# EAGLE design tenere-controller-rev-B (EAGLE 7.3.0)
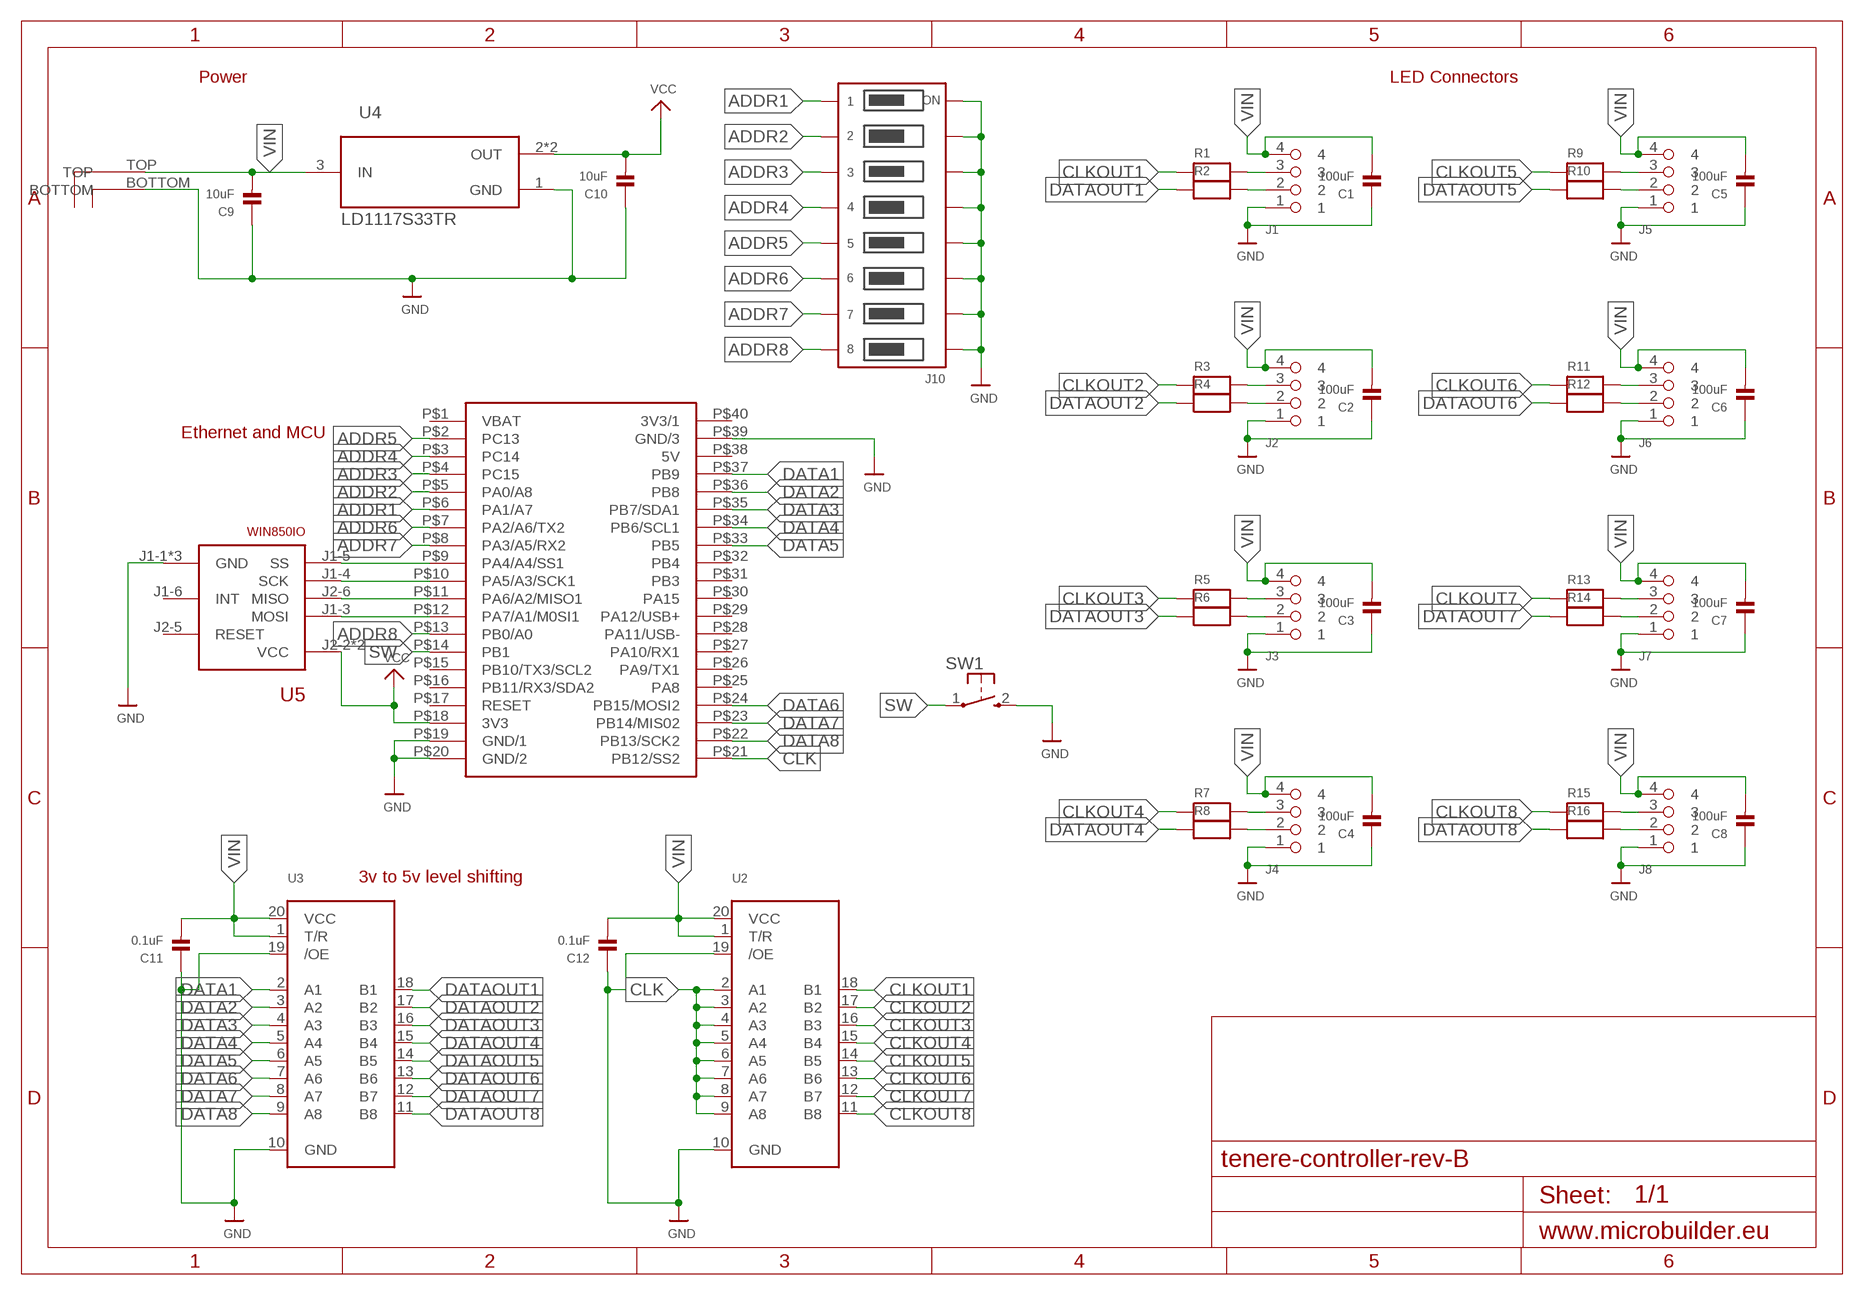
[diagram p0: schematic, sheet 1]

## Parts
C1  100uF  CAP_CERAMIC1206  [1206]
C2  100uF  CAP_CERAMIC1206  [1206]
C3  100uF  CAP_CERAMIC1206  [1206]
C4  100uF  CAP_CERAMIC1206  [1206]
C5  100uF  CAP_CERAMIC1206  [1206]
C6  100uF  CAP_CERAMIC1206  [1206]
C7  100uF  CAP_CERAMIC1206  [1206]
C8  100uF  CAP_CERAMIC1206  [1206]
C9  10uF  CAP_CERAMIC0603  [0603]
C10  10uF  CAP_CERAMIC0603  [0603]
C11  0.1uF  CAP_CERAMIC0603  [0603]
C12  0.1uF  CAP_CERAMIC0603  [0603]
J1  MICROFIT3  [43650-0400]
J2  MICROFIT3  [43650-0400]
J3  MICROFIT3  [43650-0400]
J4  MICROFIT3  [43650-0400]
J5  MICROFIT3  [43650-0400]
J6  MICROFIT3  [43650-0400]
J7  MICROFIT3  [43650-0400]
J8  MICROFIT3  [43650-0400]
J10  DIP-SWITCH-8PIN  [BPA08B]
PWR  POWERPOLE-2V  [POWERPOLE_STACKED]
R1  RESISTOR0603  [0603]
R2  RESISTOR0603  [0603]
R3  RESISTOR0603  [0603]
R4  RESISTOR0603  [0603]
R5  RESISTOR0603  [0603]
R6  RESISTOR0603  [0603]
R7  RESISTOR0603  [0603]
R8  RESISTOR0603  [0603]
R9  RESISTOR0603  [0603]
R10  RESISTOR0603  [0603]
R11  RESISTOR0603  [0603]
R12  RESISTOR0603  [0603]
R13  RESISTOR0603  [0603]
R14  RESISTOR0603  [0603]
R15  RESISTOR0603  [0603]
R16  RESISTOR0603  [0603]
SW1  TACTILE-SWITCH-1825027  [1825027]
U1  BLUEPILL  [40-DIP-BLUE-PIL]
U2  74LCX245  [TSSOP20]
U3  74LCX245  [TSSOP20]
U4  LD1117S33TR  [LD1117S33TR_SOT230P700X180-4N]
U5  WIN850IO  [WIZ850IO]

## Nets
ADDR1: J10.1'(1B) U1.P$6(PA1/A7)
ADDR2: J10.2'(2B) U1.P$5(PA0/A8)
ADDR3: J10.3'(3B) U1.P$4(PC15)
ADDR4: J10.4'(4B) U1.P$3(PC14)
ADDR5: J10.5'(5B) U1.P$2(PC13)
ADDR6: J10.6'(6B) U1.P$7(PA2/A6/TX2)
ADDR7: J10.7'(7B) U1.P$8(PA3/A5/RX2)
ADDR8: J10.8'(8B) U1.P$13(PB0/A0)
CLK: U1.P$21(PB12/SS2) U2.2(A1) U2.3(A2) U2.4(A3) U2.5(A4) U2.6(A5) U2.7(A6) U2.8(A7) U2.9(A8)
CLKOUT1: R1.1 U2.18(B1)
CLKOUT2: R3.1 U2.17(B2)
CLKOUT3: R5.1 U2.16(B3)
CLKOUT4: R7.1 U2.15(B4)
CLKOUT5: R9.1 U2.14(B5)
CLKOUT6: R11.1 U2.13(B6)
CLKOUT7: R13.1 U2.12(B7)
CLKOUT8: R15.1 U2.11(B8)
DATA1: U1.P$37(PB9) U3.2(A1)
DATA2: U1.P$36(PB8) U3.3(A2)
DATA3: U1.P$35(PB7/SDA1) U3.4(A3)
DATA4: U1.P$34(PB6/SCL1) U3.5(A4)
DATA5: U1.P$33(PB5) U3.6(A5)
DATA6: U1.P$24(PB15/MOSI2) U3.7(A6)
DATA7: U1.P$23(PB14/MIS02) U3.8(A7)
DATA8: U1.P$22(PB13/SCK2) U3.9(A8)
DATAOUT1: R2.1 U3.18(B1)
DATAOUT2: R4.1 U3.17(B2)
DATAOUT3: R6.1 U3.16(B3)
DATAOUT4: R8.1 U3.15(B4)
DATAOUT5: R10.1 U3.14(B5)
DATAOUT6: R12.1 U3.13(B6)
DATAOUT7: R14.1 U3.12(B7)
DATAOUT8: R16.1 U3.11(B8)
GND: C1.1 C2.1 C3.1 C4.1 C5.1 C6.1 C7.1 C8.1 C9.1 C10.1 C11.1 C12.1 J1.1 J2.1 J3.1 J4.1 J5.1 J6.1 J7.1 J8.1 J10.1(1A) J10.2(2A) J10.3(3A) J10.4(4A) J10.5(5A) J10.6(6A) J10.7(7A) J10.8(8A) PWR.BOTTOM SW1.2 U1.P$19(GND/1) U1.P$20(GND/2) U1.P$39(GND/3) U2.10(GND) U2.19(/OE) U3.10(GND) U3.19(/OE) U4.1(GND) U5.J1-1(GND) U5.J1-2(GND) U5.J2-1(GND)
N$1: U1.P$9(PA4/A4/SS1) U5.J1-5(SS)
N$2: U1.P$10(PA5/A3/SCK1) U5.J1-4(SCK)
N$3: U1.P$11(PA6/A2/MISO1) U5.J2-6(MISO)
N$4: U1.P$12(PA7/A1/M0SI1) U5.J1-3(MOSI)
N$5: J1.3 R1.2
N$6: J1.2 R2.2
N$7: J2.3 R3.2
N$8: J2.2 R4.2
N$9: J3.3 R5.2
N$10: J3.2 R6.2
N$11: J4.3 R7.2
N$12: J4.2 R8.2
N$13: J5.3 R9.2
N$14: J5.2 R10.2
N$15: J6.3 R11.2
N$16: J6.2 R12.2
N$17: J7.3 R13.2
N$18: J7.2 R14.2
N$19: J8.3 R15.2
N$20: J8.2 R16.2
SW: SW1.1 U1.P$14(PB1)
VCC: C10.2 U1.P$18(3V3) U4.2(OUT) U4.4(OUT) U5.J2-2(VCC) U5.J2-3(VCC)
VIN: C1.2 C2.2 C3.2 C4.2 C5.2 C6.2 C7.2 C8.2 C9.2 C11.2 C12.2 J1.4 J2.4 J3.4 J4.4 J5.4 J6.4 J7.4 J8.4 PWR.TOP U2.1(T/R) U2.20(VCC) U3.1(T/R) U3.20(VCC) U4.3(IN)
Unconnected: U1.P$1(VBAT) U1.P$15(PB10/TX3/SCL2) U1.P$16(PB11/RX3/SDA2) U1.P$17(RESET) U1.P$25(PA8) U1.P$26(PA9/TX1) U1.P$27(PA10/RX1) U1.P$28(PA11/USB-) U1.P$29(PA12/USB+) U1.P$30(PA15) U1.P$31(PB3) U1.P$32(PB4) U1.P$38(5V) U1.P$40(3V3/1) U5.J1-6(INT) U5.J2-5(RESET)

## Notes on the sheet
- Power | LED Connectors
- Ethernet and MCU
- 3v to 5v level shifting

## Library data of the parts
C1-C12 = microbuilder:CAP_CERAMIC: Ceramic Capacitors 0402 - 0402 Surface Mount Capacitors 16pF 50V 5% [Digikey: 445-4899-2-ND] 18pF 50V 5% [Digikey: 490-1281-2-ND] 22pF 50V 5% [Digikey: 490-1283-2-ND] 68pF 50V 5% [Digikey: 490-1289-2-ND] 0.1uF 10V 10% [Digikey: 490-1318-2-ND] 1.0uF 6.3V 10% [Digikey: 490-1320-2-ND] 0603 - 0603 Surface Mount Capacitors 16 pF 50V 5% [Digikey: 445-5051-2-ND] 22 pF 50V [Digikey: PCC220ACVTR-ND] 33 pF 50V 5% [Digikey: 490-1415-1-ND] 56pF 50V 5% [Digikey: 490-1421-1-ND] 220pF 50V 5% [Digikey: 445-1285-1-ND] 680 pF 50V 2200 pF 50V 5% C0G [Digikey: 445-1297-1-ND] 5600 pF 100V 5% X7R [Digikey: 478-3711-1-ND] 0.1 µF 25V 10% [Digikey: PCC2277TR-ND] 0.22 µF 16V 10% X7R [Digikey: 445-1318-1-ND] 1.0 µF 25V 10% [Digikey: 445-5146-2-ND] 0603 - RF Specific 3pF 250V +/-0.1pF RF [Digikey: 712-1347-1-ND] 18 pF 250V 5% [Digikey: 478-3505-1-ND or 712-1322-1-ND] 56 pF 250V 5% C0G RF [Digikey: 490-4867-1-ND] 68 pF 250V RF [Digikey: 490-4868-1-ND] 0805 - 0805 Surface Mount Capacitors 220 pF 250V 2% RF Ceramic Capacitor [Digikey: 712-1398-1-ND] 1000 pF 50V 2% NP0 Ceramic Capacitor [Digikey: 478-3760-1-ND] 0.1 µF 25V 10% Ceramic Capacitor [Digikey: PCC1828TR-ND] 1.0 µF 16V 10% Ceramic Capacitor[Digikey: 490-1691-2-ND] 10.0 µF 10V 10% Ceramic Capacitor[Digikey: 709-1228-1-ND] 10.0 uF 16V 10% Ceramic Capacitor [Digikey: 478-5165-2-ND] 47 uF 6.3V 20% Ceramic Capacitor [Digikey: 587-1779-1-ND or 399-5506-1-ND] 1206 - 1206 Surface Mount Capacitors 47uF 10V 20% Ceramic Capacitor [Digikey: 490-5528-1-ND or 399-5508-1-ND or 445-6010-1-ND] 100uF 6.3V -20%, +80% Y5V Ceramic Capacitor (Digikey: 490-4512-1-ND, Mouser: 81-GRM31CF50J107ZE1L)
J1-J8 = Custom:MICROFIT3
J10 = Custom:DIP-SWITCH-8PIN
PWR = Custom:POWERPOLE-2V
R1-R16 = microbuilder:RESISTOR: Resistors 0402 - 0402 Surface Mount Package 22 Ohm 1% 1/16W [Digikey: 311-22.0LRTR-ND] 33 Ohm 5% 1/16W 1.0K 5% 1/16W 1.5K 5% 1/16W 2.0K 1% 1/16W 10.0K 1% 1/16W [Digikey: 311-10.0KLRTR-ND] 10.0K 5% 1/16W [Digikey: RMCF0402JT10K0TR-ND] 12.1K 1% 1/16W [Digikey: 311-22.0LRTR-ND] 100.0K 5% 1/16W 0603 - 0603 Surface Mount Package 0 Ohm 1/10 Watt 1% Resistor 15 Ohm 1/10 Watt 1% Resistor 33 Ohm 1/10 Watt 1% Resistor 49.9 Ohm 1/10 Watt 1% Resistor 100 Ohm 1/10 Watt 1% Resistor 150 Ohm 1/10 Watt 1% Resistor 240 Ohm 1/10 Watt 1% Resistor 390 Ohm 1/10 Watt 1% Resistor 560 Ohm 1/10 Watt 1% Resistor 680 Ohm 1/10 Watt 1% Resistor 750 Ohm 1/10 Watt 1% Resistor 1.0K Ohm 1/10 Watt 1% Resistor 1.5K Ohm 1/10 Watt 1% Resistor 2.0K Ohm 1/10 Watt 1% Resistor 2.2K Ohm 1/10 Watt 1% Resistor 3.3K Ohm 1/10 Watt 1% Resistor 4.7K Ohm 1/10 Watt 1% Resistor 10.0K Ohm 1/10 Watt 1% Resistor 12.0K Ohm 1/10 Watt 1% Resistor 12.1K Ohm 1/10 Watt 1% Resistor 20.0K Ohm 1/10 Watt 1% Resistor 33.0K Ohm 1/10 Watt 1% Resistor 100.0K Ohm 1/10 Watt 1% Resistor 0805 - 0805 Surface Mount Package 0 Ohm 1/8 Watt 1% Resistor 33 Ohm 1/8 Watt 1% Resistor 100 Ohm 1/8 Watt 1% Resistor 150 Ohm 1/8 Watt 1% Resistor 200 Ohm 1/8 Watt 1% Resistor 240 Ohm 1/8 Watt 1% Resistor 330 Ohm 1/8 Watt 1% Resistor 390 Ohm 1/8 Watt 1% Resistor 470 Ohm 1/8 Watt 1% Resistor 1.0K Ohm 1/8 Watt 1% Resistor 1.5K Ohm 1/8 Watt 1% Resistor 2.0K Ohm 1/8 Watt 1% Resistor 4.7K Ohm 1/8 Watt 1% Resistor 5.1K Ohm 1/8 Watt 1% Resistor 5.6K Ohm 1/8 Watt 1% Resistor 10.0K Ohm 1/8 Watt 1% Resistor 22.0K Ohm 1/8 Watt 1% Resistor 33.0K Ohm 1/8 Watt 1% Resistor 100K Ohm 1/8 Watt 1% Resistor 1206 - 1206 Surface Mount Package 2012 - 2010 Surface Mount Package 0.11 Ohm 1/2 Watt 1% Resistor - Digikey: RHM.11UCT-ND
SW1 = Custom:TACTILE-SWITCH-1825027
U1 = maplemini:BLUEPILL
U2 U3 = microbuilder:74LCX245: 74LCX245MTC - 5.0V Tolerant Bi-Directional Buffer Can be used to interface 5.0V logic to 2.5 or 3.3V devices Digikey: 74LCX245MTCXTR-ND Mouser: 512-74LCX245MTCX
U4 = Common-Parts-Library-Eagle:LD1117S33TR: LDO Voltage Regulators 3.3V 0.8A Positive; MANUFACTURER: ST Microelectronics
U5 = Custom:WIN850IO

## Board
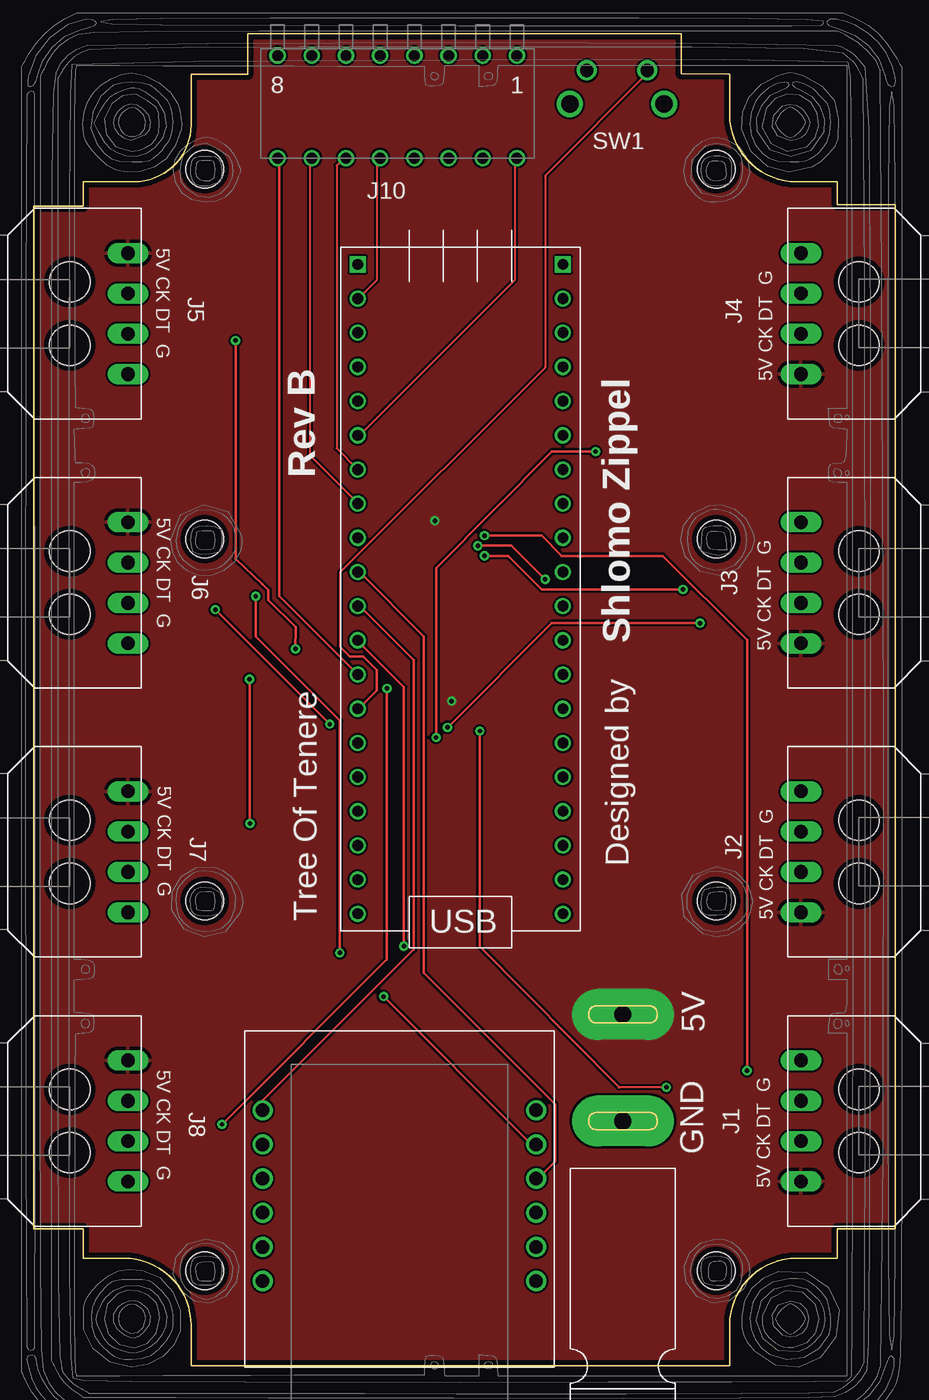
[diagram p1: board, top side]
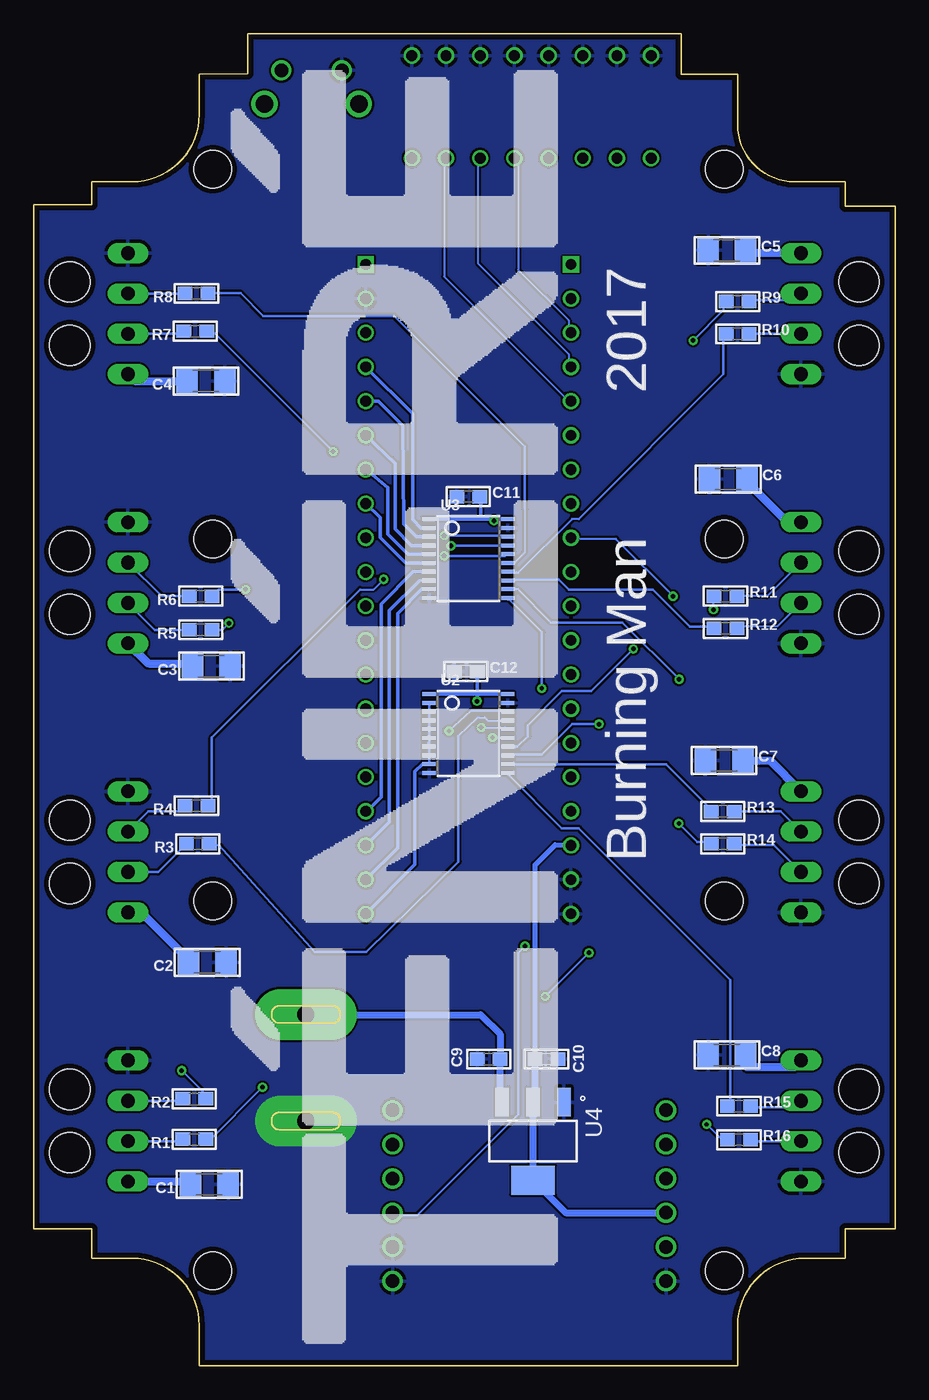
[diagram p2: board, bottom side, seen from below]

Size 64 x 99.01 mm. Coordinates in mm from the lower left corner, seen from the top.
Outline: 11.7,96 15.89,96 15.89,99.01 48.1,99.01 48.1,96.01 51.7,96 51.7,93 arc90 56.7,88 59.7,88 59.7,86.3 64,86.3 64,10.2 59.7,10.2 59.7,8 56.7,8 arc90 51.7,3 51.7,0 11.7,0 11.7,3 arc90 6.7,8 3.7,8 3.7,10.2 0,10.2 0,86.2 3.7,86.2 3.7,88 7.46,88 arc90 11.7,92.24 11.7,96
Copper layers (1*16): Top 0.0356mm / dielectric 1.5011mm / Bottom 0.0356mm
Design rules "oshpark-2layer": minimum track width 6mil, minimum drill 13mil, track to track 6mil, track to pad 6mil, pad to pad 6mil, via to via 6mil, smd to smd 6mil, copper to edge 15mil, drill to drill 6mil, minimum pad ring 7mil, minimum via ring 7mil, stop-mask expansion 4mil, vias tented up to drill 0mil, thermal gap 10mil

### Footprints (pad centres in the part's own frame; a part is rotated, then mirrored left to right if it is on the bottom)
1206 = smd 1.6 x 1.8: 1 -1.4,0; 2 1.4,0
0603 = smd 1.1 x 1: 1 -0.85,0; 2 0.85,0
43650-0400 = drill 1.02 long: 1 -4.5,0; 2 -1.5,0; 3 1.5,0; 4 4.5,0 | hole 3: -2.35,4.32; 2.35,4.32
BPA08B = drill 0.813: 1 -8.89,-3.81; 1' -8.89,3.81; 2 -6.35,-3.81; 2' -6.35,3.81; 3 -3.81,-3.81; 3' -3.81,3.81; 4 -1.27,-3.81; 4' -1.27,3.81; 5 1.27,-3.81; 5' 1.27,3.81; 6 3.81,-3.81; 6' 3.81,3.81; 7 6.35,-3.81; 7' 6.35,3.81; 8 8.89,-3.81; 8' 8.89,3.81
POWERPOLE_STACKED = drill 1.27 pad 3.8 long: BOTTOM 0,7.92; TOP 0,0
1825027 = drill 0.991: 1 -2.248,-2.489; 2 2.248,-2.489 | drill 1.295: FRAME1 -3.505,0; FRAME2 3.505,0
40-DIP-BLUE-PIL = drill 0.8 square: P$1 -7.62,22.86; P$40 7.62,22.86 | drill 0.8: P$2 -7.62,20.32; P$3 -7.62,17.78; P$4 -7.62,15.24; P$5 -7.62,12.7; P$6 -7.62,10.16; P$7 -7.62,7.62; P$8 -7.62,5.08; P$9 -7.62,2.54; P$10 -7.62,0; P$11 -7.62,-2.54; P$12 -7.62,-5.08; P$13 -7.62,-7.62; P$14 -7.62,-10.16; P$15 -7.62,-12.7; P$16 -7.62,-15.24; P$17 -7.62,-17.78; P$18 -7.62,-20.32; P$19 -7.62,-22.86; P$20 -7.62,-25.4; P$21 7.62,-25.4; P$22 7.62,-22.86; P$23 7.62,-20.32; P$24 7.62,-17.78; P$25 7.62,-15.24; P$26 7.62,-12.7; P$27 7.62,-10.16; P$28 7.62,-7.62; P$29 7.62,-5.08; P$30 7.62,-2.54; P$31 7.62,0; P$32 7.62,2.54; P$33 7.62,5.08; P$34 7.62,7.62; P$35 7.62,10.16; P$36 7.62,12.7; P$37 7.62,15.24; P$38 7.62,17.78; P$39 7.62,20.32
TSSOP20 = smd 0.305 x 0.991: 1 -2.925,-2.918; 2 -2.275,-2.918; 3 -1.625,-2.918; 4 -0.975,-2.918; 5 -0.325,-2.918; 6 0.325,-2.918; 7 0.975,-2.918; 8 1.625,-2.918; 9 2.275,-2.918; 10 2.925,-2.918; 11 2.925,2.918; 12 2.275,2.918; 13 1.625,2.918; 14 0.975,2.918; 15 0.325,2.918; 16 -0.325,2.918; 17 -0.975,2.918; 18 -1.625,2.918; 19 -2.275,2.918; 20 -2.925,2.918
LD1117S33TR_SOT230P700X180-4N = smd 2.15 x 1: 1 -2.9,2.3; 2 -2.9,0; 3 -2.9,-2.3 | smd 2.15 x 3.25: 4 2.9,0
WIZ850IO = drill 1: J1-1 -10.16,18.6; J1-2 -10.16,16.06; J1-3 -10.16,13.52; J1-4 -10.16,10.98; J1-5 -10.16,8.44; J1-6 -10.16,5.9; J2-1 10.16,18.6; J2-2 10.16,16.06; J2-3 10.16,13.52; J2-4 10.16,10.98; J2-5 10.16,8.44; J2-6 10.16,5.9
105*65 = hole 2.8: -40.95,19; -13.45,19; 13.45,19; 40.95,19; -40.95,-19; -13.45,-19; 13.45,-19; 40.95,-19

### Placement (x,y rotation side)
C1  50.95,13.49 180 bottom
C2  51.1,30 180 bottom
C3  50.8,52 180 bottom
C4  51.2,73.2 180 bottom
C5  12.5,82.9 0 bottom
C6  12.4,65.9 0 bottom
C7  12.7,45 0 bottom
C8  12.5,23.1 0 bottom
C9  30.2,22.8 0 bottom
C10  25.9,22.8 180 bottom
C11  31.7,64.6 0 bottom
C12  31.9,51.6 0 bottom
J1  57,18.2 270 top
J2  57,38.2 270 top
J3  57,58.2 270 top
J4  57,78.2 270 top
J5  7,78.2 90 top
J6  7,58.2 90 top
J7  7,38.2 90 top
J8  7,18.2 90 top
J10  27.01,93.56 180 top
PWR  43.78,26.11 180 top
R1  52.07,16.84 180 bottom
R2  52.07,19.85 180 bottom
R3  51.8,38.8 180 bottom
R4  51.9,41.63 180 bottom
R5  51.6,54.7 180 bottom
R6  51.6,57.2 180 bottom
R7  52,76.9 180 bottom
R8  51.9,79.7 180 bottom
R9  11.7,79.1 0 bottom
R10  11.7,76.7 0 bottom
R11  12.6,57.2 0 bottom
R12  12.6,54.8 0 bottom
R13  12.8,41.2 0 bottom
R14  12.8,38.8 0 bottom
R15  11.6,19.3 0 bottom
R16  11.6,16.8 0 bottom
SW1  43.34,93.79 180 top
U1  31.7,59 0 top
U2  31.7,47 270 bottom
U3  31.7,60 270 bottom
U4  26.9,16.7 270 bottom
U5  27.18,24.9 180 top
U$15  [105*65]  31.7,48 90 top

### Tracks (layer width: path | path; a pad name or v marks a point on that pad's centre or on a via)
ADDR1
  Top 0.152: U1.P$6 24.25,69.2 35.75,80.7 35.75,89.7 J10.1'
ADDR2
  Bottom 0.152: U1.P$5 24.25,71.7 33.5,80.95 33.5,89.7 J10.2'
ADDR3
  Bottom 0.152: U1.P$4 24.25,74.45 24.25,75.2 31,81.95 31,89.7 J10.3'
ADDR4
  Bottom 0.152: U1.P$3 24.25,76.95 24.25,77.7 28,81.45 28,89.45 28.25,89.7 J10.4'
ADDR5
  Top 0.152: U1.P$2 24.25,79.45 25.5,80.7 25.5,89.7 J10.5'
ADDR6
  Top 0.152: U1.P$7 22.5,68.2 22.5,89.2 23,89.7 J10.6'
ADDR7
  Top 0.152: U1.P$8 24,64.2 20.5,67.7 20.5,89.7 J10.7'
ADDR8
  Top 0.152: 24,51.45 U1.P$13 | 18.25,89.7 J10.8'
  Top 0.203: 24,51.45 18.25,57.2 18.25,89.7
CLK
  Bottom 0.203: U2.9 U2.8 U2.7 34.62,46.27 | 34.62,46.27 U2.6 | U2.2 U2.3 U2.4 U2.5 U2.6 | 34.62,46.27 34.64,46.3 34.68,46.3 34.62,46.36 U2.6
  Bottom 0.254: U1.P$21 35.67,37.25 35.67,44.16 35.11,44.73 U2.9
CLKOUT1  (via drill 0.33)
  Top 0.152: v47,20.7 43.5,20.7
  Top 0.203: v33.14,47.18 33.14,31.18 43.5,20.7
  Bottom 0.152: 28.85,48.53 U2.18 29,48.7 31.5,48.7 v33.14,47.18 | v47,20.7 51,16.7 R1.1
CLKOUT2
  Bottom 0.152: 28.85,47.9 U2.17 29,47.95 30.25,47.95 30.5,48.2 31,48.2 32.46,46.81 | 50.25,38.7 50.75,38.7 R3.1
  Bottom 0.203: 32.46,46.81 32.44,37.47 39.28,30.75 43.12,30.75 50.25,38.7
CLKOUT3  (via drill 0.33)
  Top 0.152: 38.5,55.2 v30.75,47.45
  Top 0.203: v49.5,55.2 38.5,55.2
  Bottom 0.152: 28.54,47.26 U2.16 29,47.45 v30.75,47.45
  Bottom 0.203: v49.5,55.2 50,54.7 R5.1
CLKOUT4  (via drill 0.33)
  Top 0.203: v29.9,46.7 29.93,59.28 38.5,67.95 v41.75,67.95
  Bottom 0.152: 28.85,46.62 U2.15 29,46.7 v29.9,46.7 | 50.5,76.7 51,76.7 R7.1
  Bottom 0.203: 50.5,76.7 v41.75,67.95
CLKOUT5  (via drill 0.33)
  Top 0.203: v19.45,53.28 19.47,54.87 19.47,54.89 17.44,56.92 17.44,57.66 16.98,58.12 15,59.95 v15,76.2
  Bottom 0.152: 28.22,45.99 28.25,45.99 | 28.25,45.99 28.54,45.99 U2.14 | 12.75,78.45 12.75,78.95 R9.1 | 28.25,45.95 28.25,45.99
  Bottom 0.203: 12.75,78.45 v15,76.2 | v19.45,53.28 22.59,50.14 24.76,50.14 27.3,47.6 27.3,46.79 28.06,46.03 U2.14
CLKOUT6  (via drill 0.33)
  Top 0.203: v13.5,56.2 v22,47.7
  Bottom 0.152: 28.54,45.36 U2.13 28.75,45.45 | 13.5,57.2 R11.1
  Bottom 0.203: 28.75,45.45 26.25,45.45 24,47.7 v22,47.7 | 13.5,57.2 v13.5,56.2
CLKOUT7
  Bottom 0.152: 28.22,44.72 28.25,44.72 | 28.25,44.72 28.54,44.72 U2.12 | 28.25,44.7 28.25,44.72 | 13.5,41.2 R13.1
  Bottom 0.203: 28.25,44.7 17,44.7 13.5,41.2
CLKOUT8
  Bottom 0.152: 28.54,44.09 U2.11 28.75,43.95 | 12.25,19.45 R15.1
  Bottom 0.203: 28.75,43.95 24.75,39.95 23.5,39.95 12.25,28.7 12.25,19.45
DATA1
  Bottom 0.254: U1.P$37 35.83,70.77 35.83,62.88 35.24,62.28 U3.2
DATA2
  Bottom 0.254: U3.3 35.59,61.62 36.51,62.55 36.56,69.9 38.4,71.7 U1.P$36
DATA3
  Bottom 0.254: U3.4 35.96,60.98 37.12,62.19 37.12,67.06 U1.P$35
DATA4
  Bottom 0.254: U3.5 36.23,60.35 37.68,61.84 37.68,65.28 39.3,66.62 U1.P$34
DATA5
  Bottom 0.254: U3.6 36.37,59.67 38.24,61.57 38.24,63.03 U1.P$33
DATA6
  Bottom 0.254: U1.P$24 39.25,41.22 38.19,42.28 38.19,56.62 35.79,59.03 U3.7
DATA7
  Bottom 0.203: 35.33,58.38 U3.8
  Bottom 0.254: U1.P$23 37.58,40.42 37.58,56.12 35.33,58.38
DATA8
  Bottom 0.203: 35.16,57.73 U3.9
  Bottom 0.254: U1.P$22 36.97,38.49 36.97,55.92 35.16,57.73
DATAOUT1  (via drill 0.33)
  Top 0.203: v33.5,61.7 37.75,61.7 39.25,60.2 46.75,60.2 53,53.95 v53,21.95
  Bottom 0.152: 28.85,61.55 U3.18 29,61.7 | 51,19.95 R2.1
  Bottom 0.203: v33.5,61.7 29,61.7 | 51,19.95 v53,21.95
DATAOUT2  (via drill 0.33)
  Top 0.203: v33,60.95 35.5,60.95 v38,58.45
  Bottom 0.152: 28.54,60.91 U3.17 29,60.95 | v38,58.45 38.75,57.7 39.75,57.7 | 50.75,41.45 R4.1
  Bottom 0.203: v33,60.95 29,60.95 | 39.75,57.7 50.75,46.7 50.75,41.45
DATAOUT3  (via drill 0.33)
  Top 0.203: v33.5,60.2 35.25,60.2 37.75,57.7 v48.25,57.7
  Bottom 0.152: 28.85,60.28 U3.16 29,60.2 | R6.1 50.25,57.7
  Bottom 0.203: v33.5,60.2 29,60.2 | 50.25,57.7 v48.25,57.7
DATAOUT4
  Bottom 0.152: 28.54,59.64 U3.15 28.5,59.7 28.25,59.7 27.5,60.45 27.5,63.7 | 51.25,79.7 R8.1
  Bottom 0.203: 27.5,63.7 27.5,68.33 37.2,78.03 46.93,78.03 48.63,79.73 51.02,79.73 R8.1
DATAOUT5
  Bottom 0.152: 28.54,59.01 U3.14 28.5,58.95 | 23.5,62.95 24,62.95 | 12.75,76.7 R10.1
  Bottom 0.203: 28.5,58.95 28,58.95 24,62.95 | 23.5,62.95 12.75,73.7 12.75,76.7
DATAOUT6
  Bottom 0.152: 28.22,58.37 28.54,58.37 U3.13 28.75,58.45 | 24.25,57.7 25,58.45 | 13.5,54.95 R12.1
  Bottom 0.203: 25,58.45 28.75,58.45 | 24.25,57.7 18,57.7 15.25,54.95 13.5,54.95
DATAOUT7  (via drill 0.33)
  Top 0.203: v16.07,40.31 16.07,51 v16.04,51.03
  Bottom 0.152: 28.54,57.74 U3.12 28.5,57.7 | 13.5,38.95 R14.1
  Bottom 0.203: 13.5,38.95 14.71,38.95 v16.07,40.31 | v16.04,51.03 20.26,55.25 25.57,55.25 28.05,57.73 U3.12
DATAOUT8  (via drill 0.33)
  Top 0.203: v26.25,50.35 26.25,30.2 v14,17.95
  Bottom 0.152: 28.54,57.1 U3.11 28.75,56.95 | 12.5,16.45 12.5,16.95 R16.1
  Bottom 0.203: 12.5,16.45 v14,17.95 | v26.25,50.35 26.25,54.54 U3.11
GND
  pour Bottom: -0.3,100 63.7,100 63.7,-1 -0.3,-1
N$1  (via drill 0.33)
  Top 0.152: 36.75,16.7 37.25,16.7 U5.J1-5
  Top 0.203: v16.5,57.2 16.5,54.2 22.75,47.95 v22.75,30.7 | 36.75,16.7 v26,27.45
  Bottom 0.152: 20.75,61.45 24,61.45 U1.P$9
  Bottom 0.203: v16.5,57.2 20.75,61.45 | v26,27.45 v22.75,30.7
N$2
  Top 0.152: 24.25,58.95 U1.P$10 | 37.5,13.95 U5.J1-4
  Top 0.203: 24.25,58.95 29,54.2 29,29.2 38.75,19.45 38.75,15.2 37.5,13.95
N$3
  Top 0.152: 24.25,56.45 U1.P$11 | 17,19.2 U5.J2-6
  Top 0.203: 24.25,56.45 28.25,52.45 28.25,30.95 17,19.7 17,19.2
N$4  (via drill 0.33)
  Top 0.152: 24.25,53.7 U1.P$12
  Top 0.203: 24.25,53.7 27.5,50.45 v27.5,31.2
  Bottom 0.152: 28,30.7 v27.5,31.2
  Bottom 0.203: 28,30.7 28,18.7 35.5,11.2 37.25,11.2 U5.J1-3
N$5
  Bottom 0.152: 53,16.7 R1.2
  Bottom 0.203: J1.3 53,16.7
N$6
  Bottom 0.152: 53,19.7 R2.2
  Bottom 0.203: J1.2 53,19.7
N$7
  Bottom 0.152: 52.75,38.7 R3.2
  Bottom 0.203: 52.75,38.7 54.75,36.7 J2.3
N$8
  Bottom 0.152: 52.75,41.2 R4.2
  Bottom 0.203: 52.75,41.2 55.5,41.2 J2.2
N$9
  Bottom 0.203: R5.2 55,54.7 J3.3
N$10
  Bottom 0.203: R6.2 54.5,57.2 J3.2
N$11
  Bottom 0.152: 53,76.7 R7.2
  Bottom 0.203: J4.3 53,76.7
N$12
  Bottom 0.203: J4.2 R8.2
N$13
  Bottom 0.152: J5.3 7.5,79.2 | 10.75,79.2 R9.2
  Bottom 0.203: 7.5,79.2 10.75,79.2
N$14
  Bottom 0.203: J5.2 R10.2
N$15
  Bottom 0.152: R11.2 9.5,57.2 J6.3
N$16
  Bottom 0.152: J6.2 8.75,54.95 11.75,54.95 R12.2
N$17
  Bottom 0.203: R13.2 8.5,41.2 J7.3
N$18
  Bottom 0.152: 11.75,38.7 R14.2
  Bottom 0.203: 11.75,38.7 9,38.7 J7.2
N$19
  Bottom 0.152: 10.75,19.2 R15.2
  Bottom 0.203: 10.75,19.2 7.5,19.2 J8.3
N$20
  Bottom 0.152: 10.75,16.7 R16.2
  Bottom 0.203: J8.2 10.75,16.7
SW
  Top 0.152: 23.5,52.7 22.75,53.45 22.75,58.95 38,74.2 38,88.45 45.75,96.2 SW1.1 | 24.25,48.95 U1.P$14
  Top 0.203: 24.25,48.95 25.5,50.2 25.5,51.7 24.5,52.7 23.5,52.7
VCC
  Bottom 0.381: C10.2 26.75,37.23 25.26,38.73 24.13,38.73 U1.P$18
  Bottom 0.508: U5.J2-3 24.48,11.38 U4.4 U4.2 26.75,19.75 C10.2
VIN  (via drill 0.33)
  Bottom 0.152: 31.08,51.71 C12.2 | v29.8,62.82 29.8,62.92 | 11,22.2 C8.2 | 11.25,44.95 C7.2 | 52.5,13.7 C1.2 | 11,65.7 C6.2 | 52.5,30.2 C2.2 | 11,82.7 C5.2 | 52.25,52.2 C3.2
  Bottom 0.254: U3.20 29.8,62.92 30.77,62.92 | 30.77,62.92 U3.1 | C11.2 30.77,64.6 30.77,62.92 | U2.20 31.05,49.93 | 31.05,49.93 U2.1 | C12.2 | C12.2 31.05,49.93 | v31.05,49.4 31.05,49.93
  Bottom 0.508: U4.3 29.35,19.75 C9.2 29.35,24.66 30.8,26.1 43.77,26.1 PWR.TOP
  Bottom 0.61: 11,22.2 7.5,22.2 J8.4 | 11.25,44.95 9.25,44.95 J7.4 | J1.4 52.5,13.7 | 11,65.7 8,62.7 J6.4 | 52.5,30.2 56,33.7 J2.4 | J5.4 11,82.7 | 52.25,52.2 55.5,52.2 J3.4 | C4.2 56.5,73.2 J4.4
  pour Top: -0.3,100 63.7,100 63.7,-1 -0.3,-1

### Text on the board
tPlace: SW1 | 5V CK DT G | 5V CK DT G | Rev B | 5V CK DT G | Shlomo Zippel | 5V CK DT G | Designed by | 5V CK DT G | Tree Of Tenere | 5V CK DT G | USB | 5V | 5V CK DT G | GND | 5V CK DT G
bPlace: Burning Man 2017
203bmp: /Users/shlomo/Downloads/tenere-wordmark-2 (1).bmp